# EAGLE design RadioNetwork (EAGLE 7.6.0)
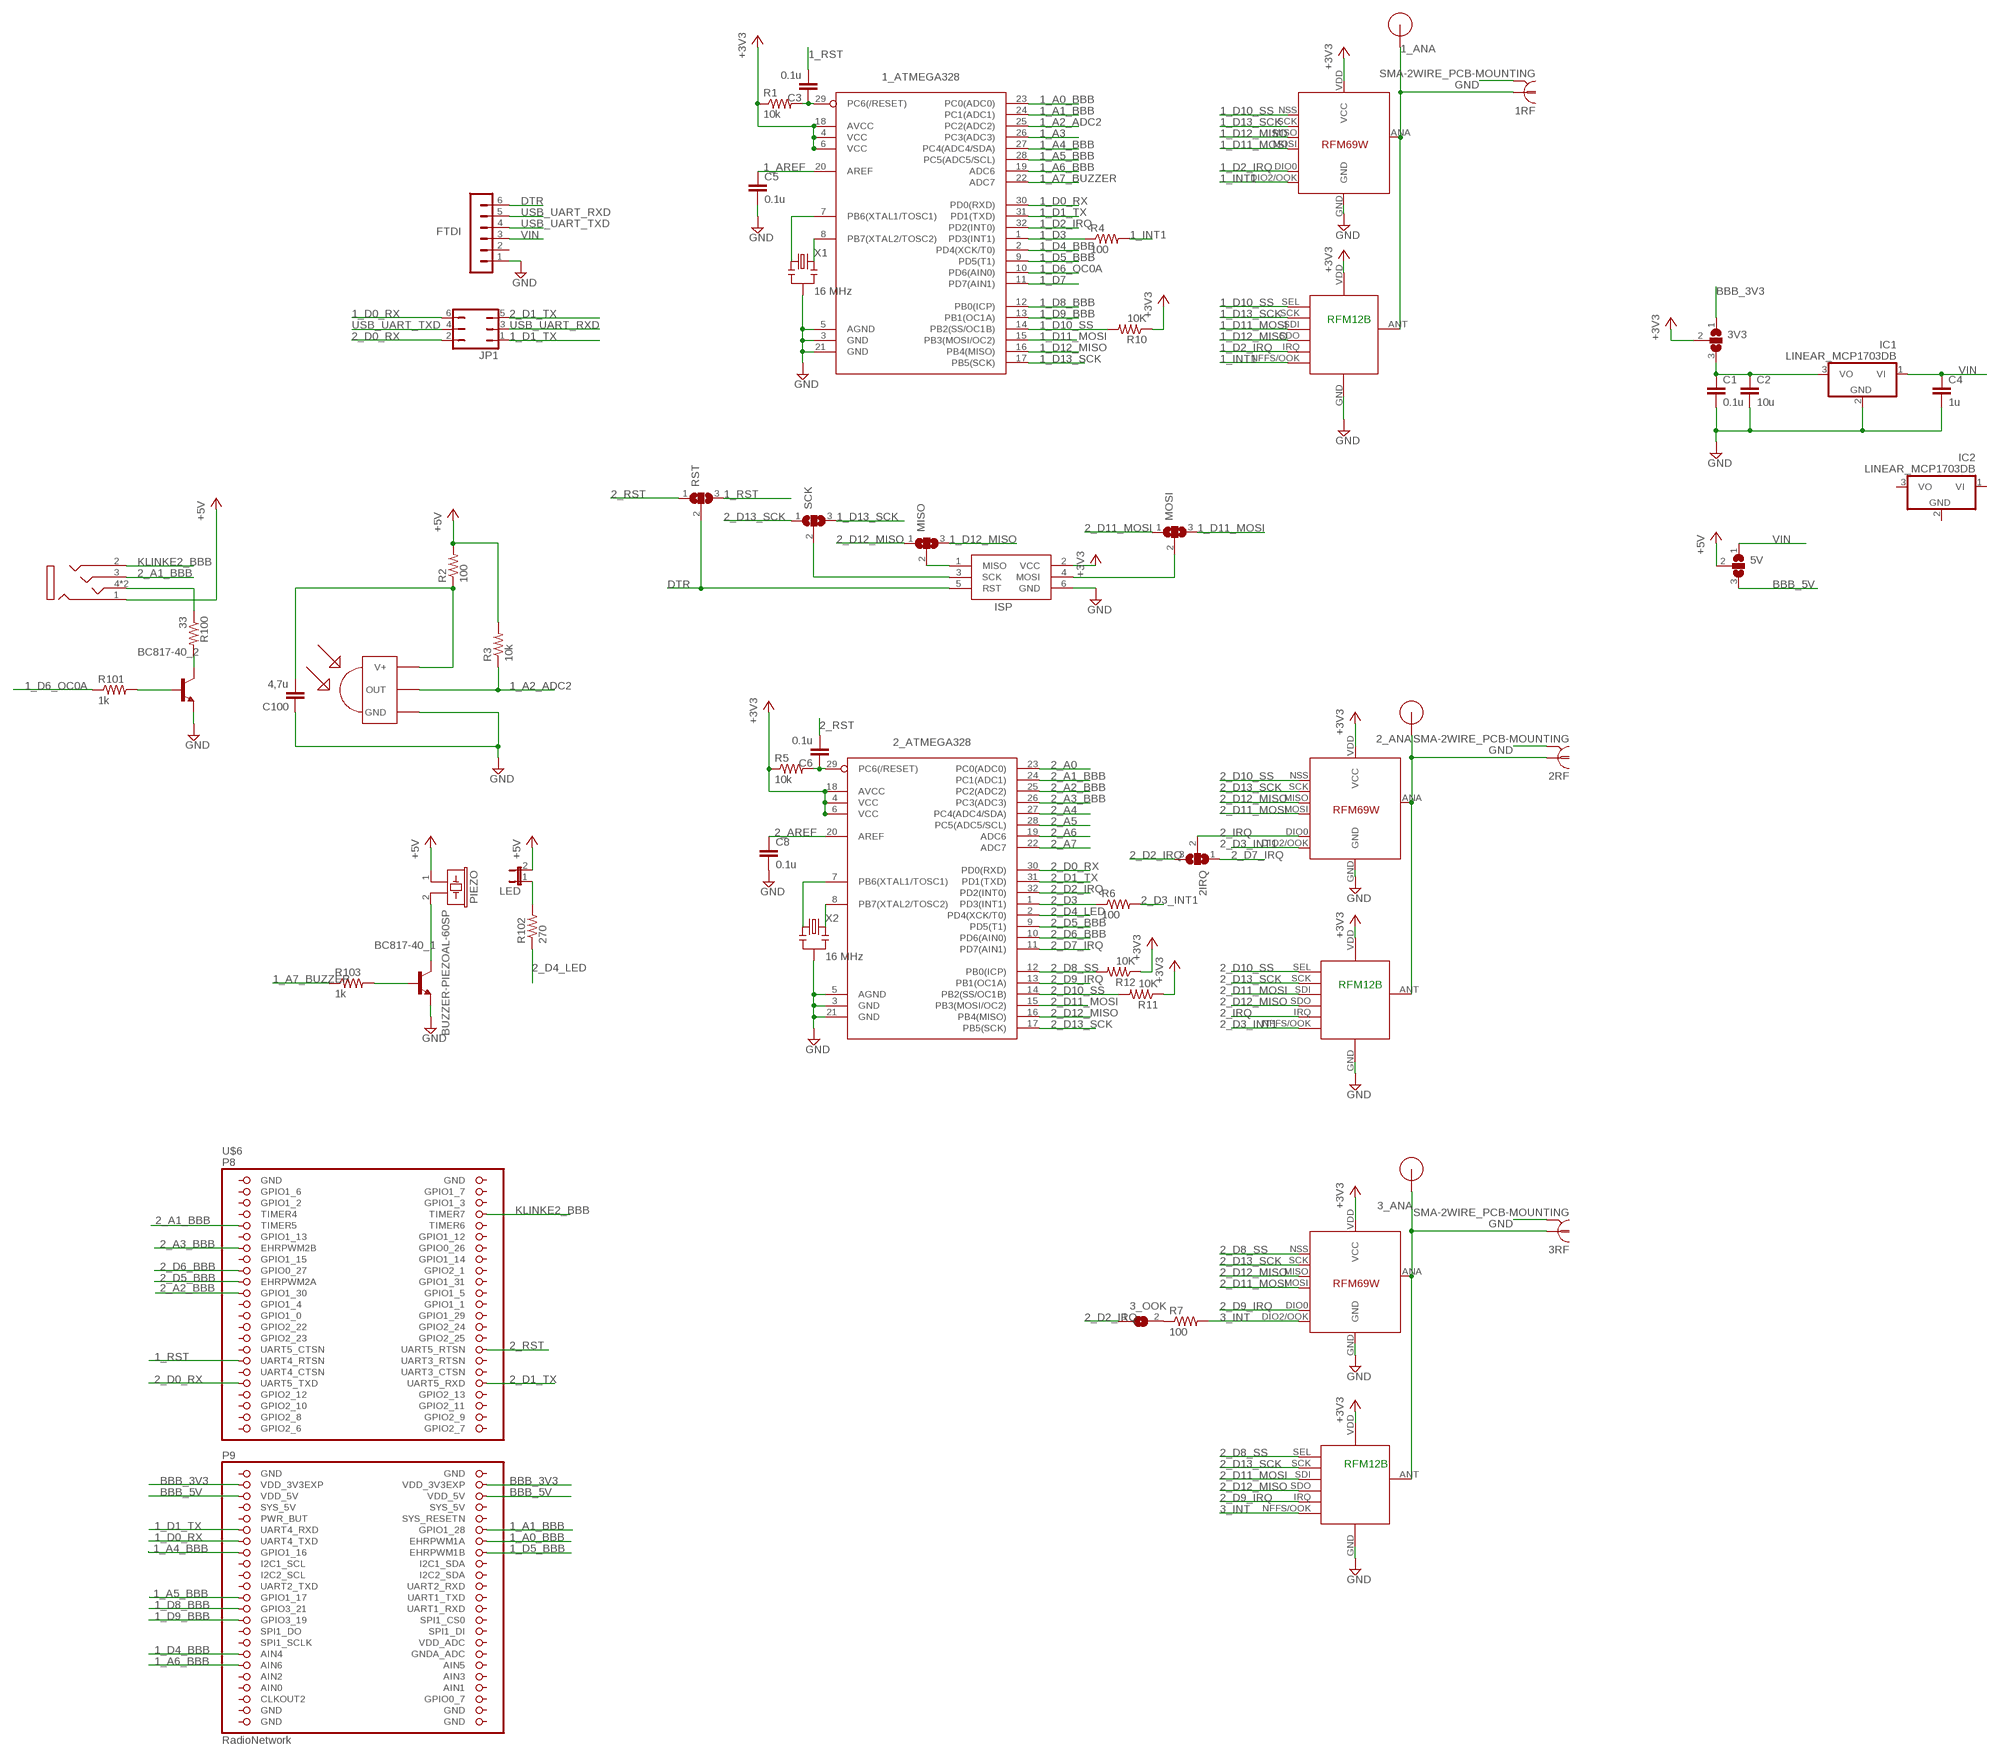
[diagram p0: schematic, sheet 1]

## Parts
1_ATMEGA328  ATMega-328  ATMEGA168/328TQFP32  [TQFP32-08]
1_RFM12B  RFM12B_MINPADS  [RFM12B-MINPADS]
1_RFM69  RFM69_MINIPADS  [RFM69W-MINPADS]
1RF  SMA-2WIRE_PCB-MOUNTING  [J01151A0931]
2_ATMEGA328  ATMega-328  ATMEGA168/328TQFP32  [TQFP32-08]
2_RFM12B  RFM12B_MINPADS  [RFM12B-MINPADS]
2_RFM69  RFM69_MINIPADS  [RFM69W-MINPADS]
2IRQ  SJ2W  [SJ_2]
2RF  SMA-2WIRE_PCB-MOUNTING  [J01151A0931]
3_OOK  SJ  [SJ]
3_RFM12B  RFM12B_MINPADS  [RFM12B-MINPADS]
3_RFM69  RFM69_MINIPADS  [RFM69W-MINPADS]
3RF  SMA-2WIRE_PCB-MOUNTING  [J01151A0931]
3V3  SJ2W  [SJ_2]
5V  SJ2W  [SJ_2]
BC817-40_1  BC817-40-NPN-SOT23-BEC  [SOT23-BEC]
BC817-40_2  BC817-40-NPN-SOT23-BEC  [SOT23-BEC]
C1  0.1u  CAP0603-CAP  [0603-CAP]
C2  10u  CAP0603-CAP  [0603-CAP]
C3  0.1u  CAP0603-CAP  [0603-CAP]
C4  1u  CAP0603-CAP  [0603-CAP]
C5  0.1u  CAP0603-CAP  [0603-CAP]
C6  0.1u  CAP0603-CAP  [0603-CAP]
C8  0.1u  CAP0603-CAP  [0603-CAP]
C100  4,7u  CAP0603-CAP  [0603-CAP]
FTDI  FTDI  MA06-1  [MA06-1]
IC1  LINEAR_MCP1703DB  [LINEAR_SOT223]
IC2  LINEAR_MCP1703DB  [LINEAR_SOT223]
IR-RX  TSOP4836  [TSOP18XX]
IR-TX  1503_13  [1503-03]
ISP  AVRISP-6  [AVRISP]
JP1  JP3Q  [JP3Q]
LED  JP1E  [JP1]
MISO  SJ2W  [SJ_2]
MOSI  SJ2W  [SJ_2]
PIEZO  BUZZER-PIEZOAL-60SP  [AL-60SP05]
R1  10k  RESISTOR0603-RES  [0603-RES]
R2  100  RESISTOR0603-RES  [0603-RES]
R3  10k  RESISTOR0603-RES  [0603-RES]
R4  100  RESISTOR0603-RES  [0603-RES]
R5  10k  RESISTOR0603-RES  [0603-RES]
R6  100  RESISTOR0603-RES  [0603-RES]
R7  100  RESISTOR0603-RES  [0603-RES]
R10  10K  RESISTOR0603-RES  [0603-RES]
R11  10K  RESISTOR0603-RES  [0603-RES]
R12  10K  RESISTOR0603-RES  [0603-RES]
R100  33  RESISTOR0603-RES  [0603-RES]
R101  1k  RESISTOR0603-RES  [0603-RES]
R102  270  RESISTOR0603-RES  [0603-RES]
R103  1k  RESISTOR0603-RES  [0603-RES]
RST  SJ2W  [SJ_2]
SCK  SJ2W  [SJ_2]
U$1  RFM12B_ANTENNA  [RFM12B-ANTENNA]
U$2  RFM12B_ANTENNA  [RFM12B-ANTENNA]
U$5  RFM12B_ANTENNA  [RFM12B-ANTENNA]
U$6  RadioNetwork  BEAGLEBONE_OUTLINE  [BEAGLEBONE_SHIELD]
X1  16 MHz  RESONATORSMD  [RESONATOR-SMD]
X2  16 MHz  RESONATORSMD  [RESONATOR-SMD]

## Nets
1_A0_BBB: 1_ATMEGA328.23(PC0(ADC0)) U$6.60(EHRPWM1A)
1_A1_BBB: 1_ATMEGA328.24(PC1(ADC1)) U$6.58(GPIO1_28)
1_A2_ADC2: 1_ATMEGA328.25(PC2(ADC2)) IR-RX.OUT R3.1
1_A3: 1_ATMEGA328.26(PC3(ADC3))
1_A4_BBB: 1_ATMEGA328.27(PC4(ADC4/SDA)) U$6.61(GPIO1_16)
1_A5_BBB: 1_ATMEGA328.28(PC5(ADC5/SCL)) U$6.69(GPIO1_17)
1_A6_BBB: 1_ATMEGA328.19(ADC6) U$6.81(AIN6)
1_A7_BUZZER: 1_ATMEGA328.22(ADC7) R103.1
1_ANA [ANT]: 1_RFM12B.ANT 1_RFM69.ANA(ANT) 1RF.1 U$1.P$1
1_AREF: 1_ATMEGA328.20(AREF) C5.1
1_D0_RX: 1_ATMEGA328.30(PD0(RXD)) JP1.6 U$6.59(UART4_TXD)
1_D1_TX: 1_ATMEGA328.31(PD1(TXD)) JP1.1 U$6.57(UART4_RXD)
1_D2_IRQ: 1_ATMEGA328.32(PD2(INT0)) 1_RFM12B.IRQ 1_RFM69.DIO0(DIO0/IRQ)
1_D3: 1_ATMEGA328.1(PD3(INT1)) R4.1
1_D4_BBB: 1_ATMEGA328.2(PD4(XCK/T0)) U$6.79(AIN4)
1_D5_BBB: 1_ATMEGA328.9(PD5(T1)) U$6.62(EHRPWM1B)
1_D6_OC0A: 1_ATMEGA328.10(PD6(AIN0)) R101.1
1_D7: 1_ATMEGA328.11(PD7(AIN1))
1_D8_BBB: 1_ATMEGA328.12(PB0(ICP)) U$6.71(GPIO3_21)
1_D9_BBB: 1_ATMEGA328.13(PB1(OC1A)) U$6.73(GPIO3_19)
1_D10_SS: 1_ATMEGA328.14(PB2(SS/OC1B)) 1_RFM12B.SEL 1_RFM69.NSS(SEL) R10.2
1_D11_MOSI: 1_ATMEGA328.15(PB3(MOSI/OC2)) 1_RFM12B.SDI(SDI/MOSI) 1_RFM69.MOSI MOSI.3
1_D12_MISO: 1_ATMEGA328.16(PB4(MISO)) 1_RFM12B.SDO(SDO/MISO) 1_RFM69.MISO MISO.3
1_D13_SCK: 1_ATMEGA328.17(PB5(SCK)) 1_RFM12B.SCK 1_RFM69.SCK SCK.3
1_INT1: 1_RFM12B.NFFS/OOK 1_RFM69.DIO2/OOK R4.2
1_RST: C3.2 RST.3 U$6.33(UART4_RTSN)
2_A0: 2_ATMEGA328.23(PC0(ADC0))
2_A1_BBB: 2_ATMEGA328.24(PC1(ADC1)) IR-TX.3 U$6.9(TIMER5)
2_A2_BBB: 2_ATMEGA328.25(PC2(ADC2)) U$6.21(GPIO1_30)
2_A3_BBB: 2_ATMEGA328.26(PC3(ADC3)) U$6.13(EHRPWM2B)
2_A4: 2_ATMEGA328.27(PC4(ADC4/SDA))
2_A5: 2_ATMEGA328.28(PC5(ADC5/SCL))
2_A6: 2_ATMEGA328.19(ADC6)
2_A7: 2_ATMEGA328.22(ADC7)
2_ANA [ANT]: 2_RFM12B.ANT 2_RFM69.ANA(ANT) 2RF.1 U$5.P$1
2_AREF: 2_ATMEGA328.20(AREF) C8.1
2_D0_RX: 2_ATMEGA328.30(PD0(RXD)) JP1.2 U$6.37(UART5_TXD)
2_D1_TX: 2_ATMEGA328.31(PD1(TXD)) JP1.5 U$6.38(UART5_RXD)
2_D2_IRQ: 2_ATMEGA328.32(PD2(INT0)) 2IRQ.3 3_OOK.1
2_D3: 2_ATMEGA328.1(PD3(INT1)) R6.1
2_D3_INT1: 2_RFM12B.NFFS/OOK 2_RFM69.DIO2/OOK R6.2
2_D4_LED: 2_ATMEGA328.2(PD4(XCK/T0)) R102.1
2_D5_BBB: 2_ATMEGA328.9(PD5(T1)) U$6.19(EHRPWM2A)
2_D6_BBB: 2_ATMEGA328.10(PD6(AIN0)) U$6.17(GPIO0_27)
2_D7_IRQ: 2_ATMEGA328.11(PD7(AIN1)) 2IRQ.1
2_D8_SS: 2_ATMEGA328.12(PB0(ICP)) 3_RFM12B.SEL 3_RFM69.NSS(SEL) R12.2
2_D9_IRQ: 2_ATMEGA328.13(PB1(OC1A)) 3_RFM12B.IRQ 3_RFM69.DIO0(DIO0/IRQ)
2_D10_SS: 2_ATMEGA328.14(PB2(SS/OC1B)) 2_RFM12B.SEL 2_RFM69.NSS(SEL) R11.2
2_D11_MOSI: 2_ATMEGA328.15(PB3(MOSI/OC2)) 2_RFM12B.SDI(SDI/MOSI) 2_RFM69.MOSI 3_RFM12B.SDI(SDI/MOSI) 3_RFM69.MOSI MOSI.1
2_D12_MISO: 2_ATMEGA328.16(PB4(MISO)) 2_RFM12B.SDO(SDO/MISO) 2_RFM69.MISO 3_RFM12B.SDO(SDO/MISO) 3_RFM69.MISO MISO.1
2_D13_SCK: 2_ATMEGA328.17(PB5(SCK)) 2_RFM12B.SCK 2_RFM69.SCK 3_RFM12B.SCK 3_RFM69.SCK SCK.1
2_IRQ: 2_RFM12B.IRQ 2_RFM69.DIO0(DIO0/IRQ) 2IRQ.2
2_RST: C6.2 RST.1 U$6.32(UART5_RTSN)
3_ANA [ANT]: 3_RFM12B.ANT 3_RFM69.ANA(ANT) 3RF.1 U$2.P$1
3_INT: 3_RFM12B.NFFS/OOK 3_RFM69.DIO2/OOK R7.2
+3V3 [power]: 1_ATMEGA328.4(VCC) 1_ATMEGA328.6(VCC) 1_ATMEGA328.18(AVCC) 1_RFM12B.VDD 1_RFM69.VDD(VCC) 2_ATMEGA328.4(VCC) 2_ATMEGA328.6(VCC) 2_ATMEGA328.18(AVCC) 2_RFM12B.VDD 2_RFM69.VDD(VCC) 3_RFM12B.VDD 3_RFM69.VDD(VCC) 3V3.2 ISP.2(VCC) R1.1 R5.1 R10.1 R11.1 R12.1
+5V [power]: 5V.2 IR-TX.1 LED.2 PIEZO.1 R2.2 R3.2
BBB_3V3 [power]: 3V3.1 U$6.49(VDD_3V3EXP) U$6.50(VDD_3V3EXP)
BBB_5V [power]: 5V.3 U$6.51(VDD_5V) U$6.52(VDD_5V)
DTR: FTDI.6 ISP.5(RST) RST.2
GND [power]: 1_ATMEGA328.3(GND) 1_ATMEGA328.5(AGND) 1_ATMEGA328.21(GND) 1_RFM12B.GND 1_RFM69.GND 1RF.G@1 1RF.G@2 1RF.G@3 1RF.G@4 2_ATMEGA328.3(GND) 2_ATMEGA328.5(AGND) 2_ATMEGA328.21(GND) 2_RFM12B.GND 2_RFM69.GND 2RF.G@1 2RF.G@2 2RF.G@3 2RF.G@4 3_RFM12B.GND 3_RFM69.GND 3RF.G@1 3RF.G@2 3RF.G@3 3RF.G@4 BC817-40_1.E BC817-40_2.E C1.2 C2.2 C4.2 C5.2 C8.2 C100.1 FTDI.1 IC1.2(GND) IR-RX.GND ISP.6(GND) X1.2 X2.2
KLINKE2_BBB: IR-TX.2 U$6.8(TIMER7)
N$1: 1_ATMEGA328.7(PB6(XTAL1/TOSC1)) X1.1
N$2 [power]: 3V3.3 C1.1 C2.1 IC1.3(VO)
N$3: 2_ATMEGA328.7(PB6(XTAL1/TOSC1)) X2.1
N$4: BC817-40_2.C R100.2
N$10: 2_ATMEGA328.8(PB7(XTAL2/TOSC2)) X2.3
N$11: 2_ATMEGA328.29(PC6(/RESET)) C6.1 R5.2
N$12: 3_OOK.2 R7.1
N$13: BC817-40_1.C PIEZO.2
N$14: 1_ATMEGA328.29(PC6(/RESET)) C3.1 R1.2
N$15: BC817-40_1.B R103.2
N$16: C100.2 IR-RX.VCC(V+) R2.1
N$17: IR-TX.4 IR-TX.4-2 R100.1
N$19: BC817-40_2.B R101.2
N$21: 1_ATMEGA328.8(PB7(XTAL2/TOSC2)) X1.3
N$22: LED.1 R102.2
N$23: ISP.1(MISO) MISO.2
N$24: ISP.4(MOSI) MOSI.2
N$25: ISP.3(SCK) SCK.2
USB_UART_RXD: FTDI.5 JP1.3
USB_UART_TXD: FTDI.4 JP1.4
VIN [power]: 5V.1 C4.1 FTDI.3 IC1.1(VI)
Unconnected: FTDI.2 IC2.1(VI) IC2.2(GND) IC2.3(VO) U$6.3(GPIO1_6) U$6.4(GPIO1_7) U$6.5(GPIO1_2) U$6.6(GPIO1_3) U$6.7(TIMER4) U$6.10(TIMER6) U$6.11(GPIO1_13) U$6.12(GPIO1_12) U$6.14(GPIO0_26) U$6.15(GPIO1_15) U$6.16(GPIO1_14) U$6.18(GPIO2_1) U$6.20(GPIO1_31) U$6.22(GPIO1_5) U$6.23(GPIO1_4) U$6.24(GPIO1_1) U$6.25(GPIO1_0) U$6.26(GPIO1_29) U$6.27(GPIO2_22) U$6.28(GPIO2_24) U$6.29(GPIO2_23) U$6.30(GPIO2_25) U$6.31(UART5_CTSN) U$6.34(UART3_RTSN) U$6.35(UART4_CTSN) U$6.36(UART3_CTSN) U$6.39(GPIO2_12) U$6.40(GPIO2_13) U$6.41(GPIO2_10) U$6.42(GPIO2_11) U$6.43(GPIO2_8) U$6.44(GPIO2_9) U$6.45(GPIO2_6) U$6.46(GPIO2_7) U$6.54(SYS_5V) U$6.55(PWR_BUT) U$6.56(SYS_RESETN) U$6.63(I2C1_SCL) U$6.64(I2C1_SDA) U$6.65(I2C2_SCL) U$6.66(I2C2_SDA) U$6.67(UART2_TXD) U$6.68(UART2_RXD) U$6.70(UART1_TXD) U$6.72(UART1_RXD) U$6.74(SPI1_CS0) U$6.75(SPI1_DO) U$6.76(SPI1_DI) U$6.77(SPI1_SCLK) U$6.78(VDD_ADC) U$6.80(GNDA_ADC) U$6.82(AIN5) U$6.83(AIN2) U$6.84(AIN3) U$6.86(AIN1) U$6.87(CLKOUT2) U$6.88(GPIO0_7)

## Notes on the sheet
- RFM12B
- RFM12B
- RFM12B

## Power pins joined to a net without a drawn wire
AIN0: U$6.85(AIN0)
GND: U$6.1(GND) U$6.2(GND) U$6.47(GND) U$6.48(GND) U$6.89(GND) U$6.90(GND) U$6.91(GND) U$6.92(GND)
SYS_5V: U$6.53(SYS_5V)

## Library data of the parts
1_ATMEGA328 2_ATMEGA328 = myLib:ATMEGA168/328: Atmel 32-pin 8-bit micro, 16k flash.; BUERKLIN: 64 S 3046
1_RFM12B 2_RFM12B 3_RFM12B = myLib:RFM12B_MINPADS
1_RFM69 2_RFM69 3_RFM69 = myLib:RFM69_MINIPADS
1RF 2RF 3RF = myLib:SMA-2WIRE_PCB-MOUNTING: SMA 50 Ohm Straight Jack Receptacle - PCB Mountung www.telegaertner.de Source: Buerklin Artikelnummer: J01151A0931; BUERKLIN: 76F410
2IRQ 3V3 5V MISO MOSI RST SCK = jumper:SJ2W: SMD solder JUMPER
3_OOK = jumper:SJ: SMD solder JUMPER
BC817-40_1 BC817-40_2 = myLib:*-NPN-: NPN Transistror BF959 corrected 2008.03.06; BUERKLIN: 12S6220
C1 C3 C5 C6 C8 = LowPowerLab:CAP: Capacitor Standard 0603 ceramic capacitor, and 0.1" leaded capacitor.; BUERKLIN: 53 D 1726
C2 = LowPowerLab:CAP: Capacitor Standard 0603 ceramic capacitor, and 0.1" leaded capacitor.; BUERKLIN: 53 D 1652
C4 = LowPowerLab:CAP: Capacitor Standard 0603 ceramic capacitor, and 0.1" leaded capacitor.; BUERKLIN: 53 D 1657
C100 = LowPowerLab:CAP: Capacitor Standard 0603 ceramic capacitor, and 0.1" leaded capacitor.; BUERKLIN: 53 D 1659
FTDI = JeeLabs:MA06-1: PIN HEADER; BUERKLIN: 59 F 2134
IC1 IC2 = myLib:LINEAR_MCP1703: 250 mA, 16V, Low Quiescent Current LDO Regulator Source: http://ww1.microchip.com/downloads/en/DeviceDoc/22049b.pdf; BUERKLIN: 41 S 7654
IR-RX = myLib:TSOP4836: IR Receiver and Demodulator; CONRAD: 171107-62
IR-TX = myLib:1503_13; BUERKLIN: 39F1215
ISP = adafruit:AVRISP: AVR ISP HEADER Standard 6 pin header for AVR programming; CONRAD: 737480 - 62
JP1 = myLib:JP3Q: JUMPER; CONRAD: 737480 - 62
LED = jumper:JP1E: JUMPER
PIEZO = myLib:BUZZER-PIEZO: Piezoelectric Acoustic Transducer; CONRAD: 751553 - 62; OC_FARNELL: unknown; OC_NEWARK: unknown
R1 R3 R5 R10-R12 = LowPowerLab:RESISTOR: Resistor Basic schematic elements and footprints for 0603, 1206, and PTH resistors.; BUERKLIN: 26 E 816
R2 R4 R6 R7 = LowPowerLab:RESISTOR: Resistor Basic schematic elements and footprints for 0603, 1206, and PTH resistors.; BUERKLIN: 26 E 768
R100 = LowPowerLab:RESISTOR: Resistor Basic schematic elements and footprints for 0603, 1206, and PTH resistors.; BUERKLIN: 26 E 756
R101 R103 = LowPowerLab:RESISTOR: Resistor Basic schematic elements and footprints for 0603, 1206, and PTH resistors.; BUERKLIN: 26 E 792
R102 = LowPowerLab:RESISTOR: Resistor Basic schematic elements and footprints for 0603, 1206, and PTH resistors.; BUERKLIN: 26 E 778
U$1 U$2 U$5 = LowPowerLab:RFM12B_ANTENNA
U$6 = myLib:BEAGLEBONE_OUTLINE: Should match A3 pinout - but not completely tested; CONRAD: 393509 - 62
X1 X2 = SparkFun:RESONATOR: Resonator Small SMD resonator. This is the itty bitty 10/20MHz resonators with built in caps. CSTCE10M0G55 and CSTCE20M0V53. Footprint has been reviewed closely but hasn't been tested yet.

## Net classes
1 power: width 0.356 mm, clearance 0.254 mm
2 ANT: width 0.381 mm, clearance 0.254 mm

## Board
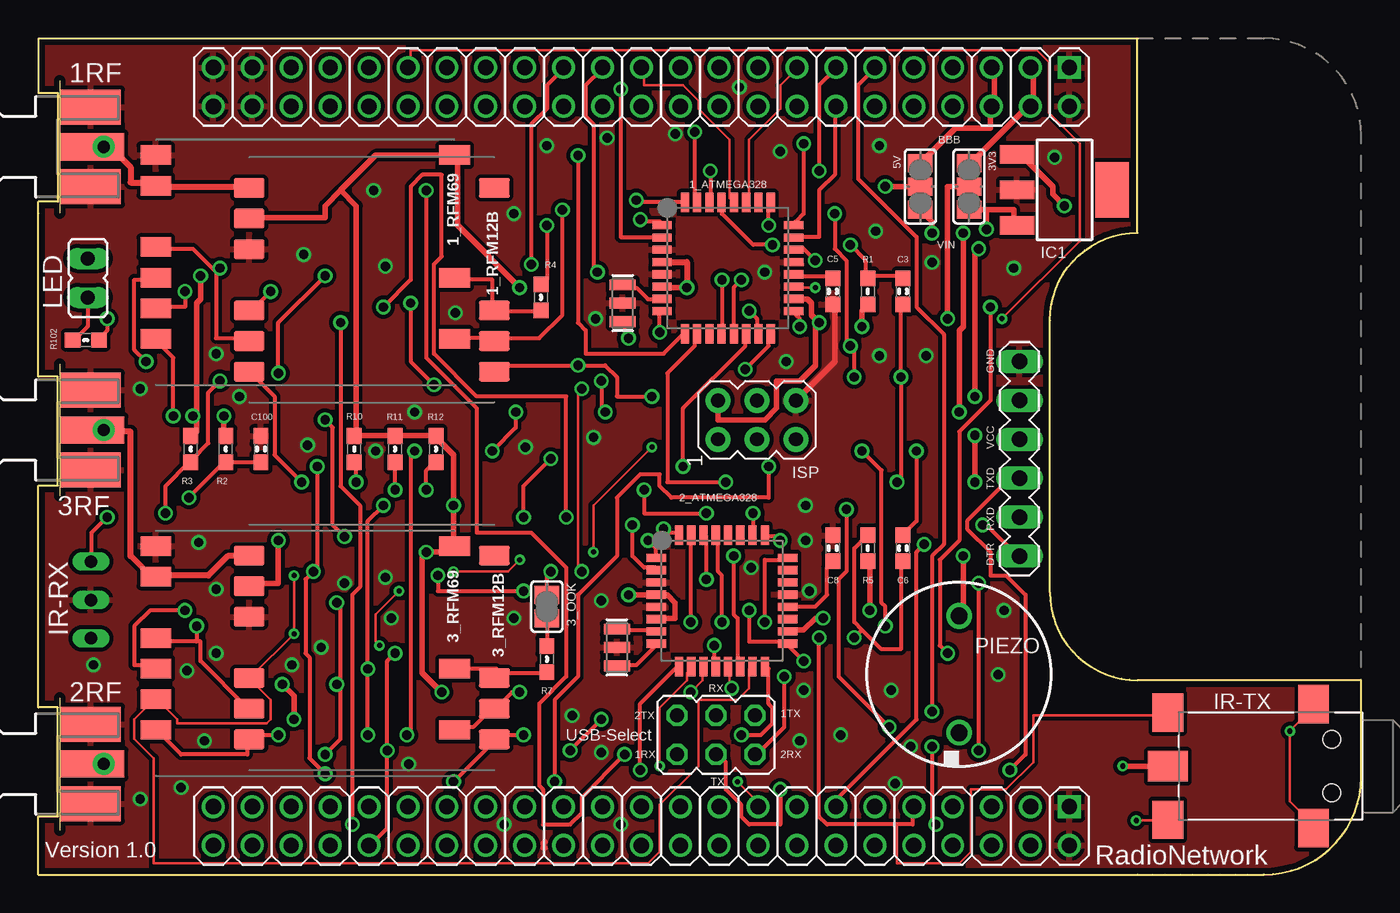
[diagram p1: board, top side]
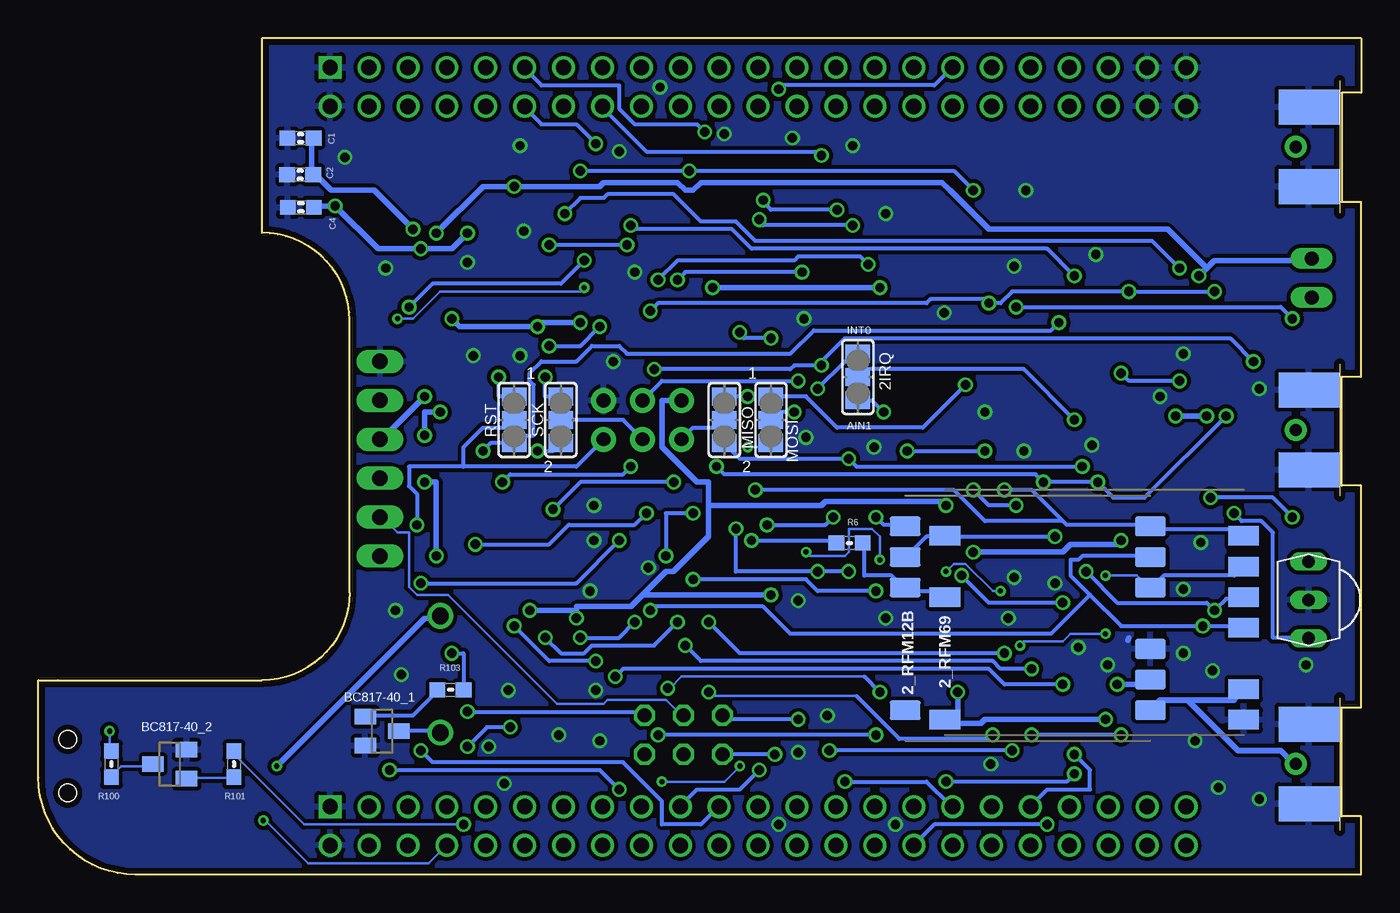
[diagram p2: board, bottom side, seen from below]

Size 86.36 x 54.61 mm. Coordinates in mm from the lower left corner, seen from the top.
Copper layers (1*16): Top 0.0356mm / dielectric 1.5011mm / Bottom 0.0356mm
Design rules "LaenPCBOrder": minimum track width 6mil, minimum drill 13mil, track to track 6mil, track to pad 6mil, pad to pad 6mil, via to via 6mil, smd to smd 6mil, copper to edge 15mil, drill to drill 6mil, minimum pad ring 7mil, minimum via ring 7mil, stop-mask expansion 3mil, vias tented up to drill 0mil, thermal gap 10mil

### Footprints (pad centres in the part's own frame; a part is rotated, then mirrored left to right if it is on the bottom)
TQFP32-08 = smd 1.27 x 0.533: 1 -4.293,2.8; 2 -4.293,2; 3 -4.293,1.2; 4 -4.293,0.4; 5 -4.293,-0.4; 6 -4.293,-1.2; 7 -4.293,-2; 8 -4.293,-2.8; 17 4.293,-2.8; 18 4.293,-2; 19 4.293,-1.2; 20 4.293,-0.4; 21 4.293,0.4; 22 4.293,1.2; 23 4.293,2; 24 4.293,2.8 | smd 0.533 x 1.27: 9 -2.8,-4.293; 10 -2,-4.293; 11 -1.2,-4.293; 12 -0.4,-4.293; 13 0.4,-4.293; 14 1.2,-4.293; 15 2,-4.293; 16 2.8,-4.293; 25 2.8,4.293; 26 2,4.293; 27 1.2,4.293; 28 0.4,4.293; 29 -0.4,4.293; 30 -1.2,4.293; 31 -2,4.293; 32 -2.8,4.293
RFM12B-MINPADS = smd 2 x 1.27: ANT 8,-6; GND 8,-2; IRQ -8,4; NFFS/OOK -8,2; SCK 8,4; SDI 8,2; SDI1 -8.002,-6.001; SDO -8,6; SEL 8,6; VDD 8,-4
RFM69W-MINPADS = smd 2 x 1.27: ANA 8,-5; DIO0 -11.5,5; DIO2/OOK -11.5,1; GND 8,-7; MISO 8,1; MOSI 8,3; NSS 8,5; SCK 8,-1; VDD -11.5,-7
J01151A0931 = smd 4.191 x 1.778: 1 2.134,0 | smd 3.937 x 2.286: G@1 2.032,2.6; G@2 2.032,-2.6 | smd 3.937 x 2.286 bottom: G@3 2.032,2.6; G@4 2.032,-2.6
SJ_2 = smd 1.168 x 1.6: 1 -1.524,0; 2 0,0; 3 1.524,0
SJ = smd 1.168 x 1.6: 1 -0.762,0; 2 0.762,0
SOT23-BEC = smd 1 x 1.4: B -0.95,-1.1; C 0,1.1; E 0.95,-1.1
0603-CAP = smd 1.016 x 0.965: 1 -0.85,0; 2 0.85,0
MA06-1 = drill 1.016 long: 1 0,0; 2 2.54,0; 3 5.08,0; 4 7.62,0; 5 10.16,0; 6 12.7,0
LINEAR_SOT223 = smd 1.219 x 2.235: 1 -2.311,-3.099; 2 0,-3.099; 3 2.311,-3.099 | smd 3.6 x 2.2: 4 0,3.099
TSOP18XX = drill 0.813 long: GND -0.001,-0.027; OUT -2.501,-0.027; VCC 2.499,-0.027
1503-03 = smd 2.6 x 2: 1 12.7,0 | smd 2 x 2.5: 2 12.7,3.5; 3 12.7,-3.5; 4 3.2,4.05; 4-2 3.2,-4.05 | hole 1.15: 2,-1.75; 2,1.75
AVRISP = drill 0.9 pad 1.626: 1 -1.27,2.54; 2 1.27,2.54; 3 -1.27,0; 4 1.27,0; 5 -1.27,-2.54; 6 1.27,-2.54
JP3Q = drill 0.914 octagon: 1 -2.54,-1.27; 2 -2.54,1.27; 3 0,-1.27; 4 0,1.27; 5 2.54,-1.27; 6 2.54,1.27
JP1 = drill 0.914 long: 1 0,-1.27; 2 0,1.27
AL-60SP05 = drill 1.1 pad 1.676: 1 -3.81,0; 2 3.81,0
0603-RES = smd 1.016 x 0.965: 1 -0.85,0; 2 0.85,0
RFM12B-ANTENNA = drill 0.8 pad 1.422: P$1 0,0
BEAGLEBONE_SHIELD = drill 1 square: 1 4.445,19.05; 47 52.705,19.05 | drill 1: 2 1.905,19.05; 3 4.445,21.59; 4 1.905,21.59; 5 4.445,24.13; 6 1.905,24.13; 7 4.445,26.67; 8 1.905,26.67; 9 4.445,29.21; 10 1.905,29.21; 11 4.445,31.75; 12 1.905,31.75; 13 4.445,34.29; 14 1.905,34.29; 15 4.445,36.83; 16 1.905,36.83; 17 4.445,39.37; 18 1.905,39.37; 19 4.445,41.91; 20 1.905,41.91; 21 4.445,44.45; 22 1.905,44.45; 23 4.445,46.99; 24 1.905,46.99; 25 4.445,49.53; 26 1.905,49.53; 27 4.445,52.07; 28 1.905,52.07; 29 4.445,54.61; 30 1.905,54.61; 31 4.445,57.15; 32 1.905,57.15; 33 4.445,59.69; 34 1.905,59.69; 35 4.445,62.23; 36 1.905,62.23; 37 4.445,64.77; 38 1.905,64.77; 39 4.445,67.31; 40 1.905,67.31; 41 4.445,69.85; 42 1.905,69.85; 43 4.445,72.39; 44 1.905,72.39; 45 4.445,74.93; 46 1.905,74.93; 48 50.165,19.05; 49 52.705,21.59; 50 50.165,21.59; 51 52.705,24.13; 52 50.165,24.13; 53 52.705,26.67; 54 50.165,26.67; 55 52.705,29.21; 56 50.165,29.21; 57 52.705,31.75; 58 50.165,31.75; 59 52.705,34.29; 60 50.165,34.29; 61 52.705,36.83; 62 50.165,36.83; 63 52.705,39.37; 64 50.165,39.37; 65 52.705,41.91; 66 50.165,41.91; 67 52.705,44.45; 68 50.165,44.45; 69 52.705,46.99; 70 50.165,46.99; 71 52.705,49.53; 72 50.165,49.53; 73 52.705,52.07; 74 50.165,52.07; 75 52.705,54.61; 76 50.165,54.61; 77 52.705,57.15; 78 50.165,57.15; 79 52.705,59.69; 80 50.165,59.69; 81 52.705,62.23; 82 50.165,62.23; 83 52.705,64.77; 84 50.165,64.77; 85 52.705,67.31; 86 50.165,67.31; 87 52.705,69.85; 88 50.165,69.85; 89 52.705,72.39; 90 50.165,72.39; 91 52.705,74.93; 92 50.165,74.93
RESONATOR-SMD = smd 0.7 x 1.7: 1 -1.2,0; 2 0,0; 3 1.2,0

### Placement (x,y rotation side)
1_ATMEGA328  45.01,39.6 0 top
1_RFM12B  21.77,38.84 180 top
1_RFM69  15.67,39.98 180 top
1RF  1.38,47.52 0 top
2_ATMEGA328  44.63,17.88 0 top
2_RFM12B  21.77,16.74 0 bottom
2_RFM69  15.67,17.12 0 bottom
2IRQ  32.86,32.5 90 bottom
2RF  1.38,7.23 0 top
3_OOK  33.2,17.5 270 top
3_RFM12B  21.77,14.84 180 top
3_RFM69  15.67,14.46 180 top
3RF  1.38,29.03 0 top
3V3  60.76,44.94 270 top
5V  57.58,44.94 90 top
BC817-40_1  63.91,9.37 270 bottom
BC817-40_2  77.78,7.22 90 bottom
C1  69.23,48.09 180 bottom
C2  69.27,45.7 180 bottom
C3  56.44,38.08 270 top
C4  69.22,43.56 180 bottom
C5  51.87,38.08 270 top
C6  56.44,21.31 90 top
C8  51.87,21.31 90 top
C100  14.53,27.79 270 top
FTDI  64.06,33.51 270 top
IC1  67,44.71 270 top
IC2  -20.14,-5.36 0 top  (outside the outline)
IR-RX  3.46,17.94 90 bottom
IR-TX  86.44,7.09 180 top
ISP  46.91,29.7 90 top
JP1  44.25,9.12 180 top
LED  3.24,38.95 0 top
MISO  41.58,29.7 90 bottom
MOSI  38.53,29.7 90 bottom
PIEZO  60.11,13.08 270 top
R1  54.15,38.08 90 top
R2  12.24,27.79 90 top
R3  9.96,27.79 90 top
R4  32.82,37.7 270 top
R5  54.15,21.31 90 top
R6  33.41,21.65 0 bottom
R7  33.2,14.07 270 top
R10  20.62,27.79 270 top
R11  23.29,27.79 270 top
R12  25.96,27.79 270 top
R100  81.58,7.22 270 bottom
R101  73.58,7.22 270 bottom
R102  3.1,34.9 180 top
R103  59.45,12.07 180 bottom
RST  55.3,29.7 90 bottom
SCK  52.25,29.7 90 bottom
U$1  4.26,47.52 0 top
U$2  4.26,29.03 0 top
U$5  4.26,7.23 0 top
U$6  86.36,0 90 top
X1  38.15,37.32 270 top
X2  37.77,14.84 270 top

### Tracks (layer width: path | path; a pad name or v marks a point on that pad's centre or on a via)
1_A0_BBB
  Top 0.254: 1_ATMEGA328.23 49.45,41.63 50.98,41.63 50.98,44.68 51.99,45.7 51.99,50.02 U$6.60
1_A1_BBB  (via drill 0.61)
  Top 0.254: v49.96,47.73 49.96,43.16 49.45,42.65 1_ATMEGA328.24
  Bottom 0.254: U$6.58 54.53,50.02 53.52,49 51.99,49 51.23,49 v49.96,47.73
1_A2_ADC2  (via drill 0.61)
  Top 0.254: v8.31,23.6 8.31,25.38 9.83,26.9 R3.1 10.08,27.16 11.1,28.17 11.1,31.47 v11.86,32.24 | v47.68,42.4 47.68,43.67 1_ATMEGA328.25 | v18.72,39.09 15.67,36.05 v15.67,32.74
  Bottom 0.254: v8.31,23.6 7.8,23.09 6.53,23.09 5.77,22.33 5.77,15.47 3.48,15.47 IR-RX.OUT | v47.68,42.4 47.42,42.14 41.07,42.14 39.8,40.87 20.5,40.87 v18.72,39.09 | v15.67,32.74 15.16,32.24 v11.86,32.24
1_A4_BBB
  Top 0.152: 1_ATMEGA328.27 46.41,43.92 46.41,47.98 48.44,50.02 48.44,51.54 49.45,52.56 U$6.61
1_A5_BBB
  Top 0.152: 1_ATMEGA328.28 45.39,43.92 45.14,44.17 45.14,47.98 43.1,50.02 43.1,50.52 42.09,51.54 39.55,51.54 39.55,52.56 U$6.69
1_A6_BBB  (via drill 0.33)
  Top 0.152: v50.72,38.33 49.45,38.33 1_ATMEGA328.19 | v62.92,36.3 68,41.38 68,47.73 65.96,49.76 65.96,53.06 65.2,53.83 24.31,53.83 24.31,52.81 U$6.81
  Bottom 0.152: v50.72,38.33 50.98,38.08 60.12,38.08 61.9,36.3 v62.92,36.3
1_A7_BUZZER  (via drill 0.61)
  Top 0.254: v59.36,14.46 58.85,14.96 58.85,20.55 60.12,21.82 60.12,28.93 62.15,30.97 v62.15,37.06 | v50.72,40.11 49.96,40.87 49.45,40.87 1_ATMEGA328.22
  Bottom 0.254: v59.36,14.46 58.6,14.46 58.6,12.17 R103.1 | v62.15,37.06 60.63,38.59 52.25,38.59 v50.72,40.11
1_ANA
  Top 0.381: 1RF.1 3.73,47.22 4.24,47.22 U$1.P$1 4.5,47.73 6.02,46.21 6.02,45.19 7.54,45.19 1_RFM69.ANA 7.8,44.94 13.64,44.94 1_RFM12B.ANT
1_AREF
  Top 0.254: C5.1 51.74,39.09 49.45,39.09 1_ATMEGA328.20
1_D0_RX  (via drill 0.61)
  Top 0.254: v43.87,45.95 43.87,43.92 1_ATMEGA328.30 | v50.98,45.95 50.98,51.54 51.99,52.56 U$6.59 | v38.28,7.85 35.48,5.06 35.48,4.04 34.72,3.28 32.94,3.28 32.94,5.57 32.69,5.82 32.69,11.15 34.47,12.93 34.47,20.04 32.18,22.33 28.63,22.33 28.63,30.46 25.32,33.76 v25.32,44.68
  Bottom 0.254: v50.98,45.95 v43.87,45.95 26.59,45.95 v25.32,44.68 | v38.28,7.85 41.58,7.85 JP1.6
1_D1_TX  (via drill 0.61)
  Top 0.254: v42.85,48.49 42.85,43.92 1_ATMEGA328.31 | v58.34,10.65 58.34,20.81 59.11,21.57 59.11,35.28 57.33,37.06 57.33,41.63 53.52,45.44 53.52,51.54 54.53,52.56 U$6.57
  Bottom 0.254: v42.85,48.49 43.36,49 47.42,49 48.44,50.02 48.44,51.54 53.52,51.54 54.53,52.56 U$6.57 | v58.34,10.65 47.17,10.65 46.91,10.39 JP1.1
1_D2_IRQ  (via drill 0.61)
  Top 0.254: v34.21,43.41 34.21,36.55 32.69,35.03 29.9,35.03 1_RFM12B.IRQ 29.64,35.03 27.36,35.03 1_RFM69.DIO0 | 42.09,43.67 1_ATMEGA328.32 42.09,43.92 39.04,43.92 v39.04,44.05
  Bottom 0.254: v34.21,43.41 38.53,43.41 39.04,43.92 v39.04,44.05
1_D3  (via drill 0.61)
  Top 0.254: v33.2,42.4 33.2,38.84 32.94,38.59 R4.1 | 40.56,42.4 1_ATMEGA328.1 40.56,42.65 39.29,42.65 v39.29,42.78
  Bottom 0.254: v33.2,42.4 39.04,42.4 39.29,42.65 v39.29,42.78
1_D4_BBB  (via drill 0.61)
  Top 0.254: 40.56,41.63 1_ATMEGA328.2 40.56,41.63 | 40.56,41.63 38.02,41.63 v38.02,51.29
  Bottom 0.254: v38.02,51.29 37.77,51.54 27.86,51.54 26.85,52.56 U$6.79
1_D5_BBB  (via drill 0.61)
  Top 0.254: v35.23,46.97 35.23,36.05 35.74,35.54 35.74,34.01 40.82,34.01 42.09,35.28 1_ATMEGA328.9
  Bottom 0.254: v35.23,46.97 35.48,47.22 46.66,47.22 49.45,50.02 U$6.62
1_D6_OC0A  (via drill 0.61)
  Top 0.254: v58.6,3.28 58.34,3.53 v58.34,8.36 | v55.55,9.63 52.25,12.93 52.25,19.28 52.76,19.79 v52.76,23.85 | v44.88,25.63 41.07,25.63 41.07,32.74 42.85,34.52 42.85,35.28 1_ATMEGA328.10
  Bottom 0.152: v58.6,3.28 69.01,3.28 73.58,7.85 R101.1
  Bottom 0.254: v58.34,8.36 57.07,9.63 v55.55,9.63 | v52.76,23.85 50.98,25.63 v44.88,25.63
1_D8_BBB  (via drill 0.61)
  Top 0.254: v44.63,38.84 44.63,35.54 1_ATMEGA328.12 | v36.5,39.35 36.25,39.6 36.25,49 35.74,49.51 35.74,51.54 36.75,52.56 U$6.71
  Bottom 0.254: v44.63,38.84 44.12,39.35 v36.5,39.35
1_D9_BBB  (via drill 0.61)
  Top 0.254: v45.9,38.84 45.39,38.33 45.39,35.54 1_ATMEGA328.13 | v32.18,39.86 32.18,49 33.2,50.02 33.2,51.54 34.21,52.56 U$6.73
  Bottom 0.254: v45.9,38.84 44.63,40.11 37.01,40.11 36.75,40.36 32.69,40.36 v32.18,39.86
1_D10_SS  (via drill 0.61)
  Top 0.254: v20.75,25.63 20.75,26.9 R10.2 | v17.2,25.63 15.42,27.41 15.42,31.22 13.89,32.74 1_RFM12B.SEL | v42.09,26.65 42.09,30.46 46.15,34.52 46.15,35.28 1_ATMEGA328.14 | v8.81,29.95 8.81,33.76 7.8,34.78 1_RFM69.NSS
  Bottom 0.254: v42.09,26.65 41.58,26.14 21.26,26.14 v20.75,25.63 v17.2,25.63 16.18,24.62 14.15,24.62 v8.81,29.95
1_D11_MOSI  (via drill 0.61)
  Top 0.254: v46.41,36.81 46.91,36.3 46.91,35.54 1_ATMEGA328.15 | v15.16,38.08 13.89,36.81 1_RFM12B.SDI | v25.83,31.98 24.31,33.51 v24.31,37.32 | v9.58,38.08 9.58,37.06 7.8,37.06 1_RFM69.MOSI
  Bottom 0.254: v46.41,36.81 45.9,37.32 28.37,37.32 28.12,37.57 24.56,37.57 v24.31,37.32 23.55,37.32 22.78,38.08 v15.16,38.08 v9.58,38.08 | MOSI.3 36.25,31.22 34.21,29.19 28.63,29.19 v25.83,31.98
1_D12_MISO  (via drill 0.61)
  Top 0.254: v46.15,33 47.68,34.52 47.68,35.28 1_ATMEGA328.16 | 1_RFM12B.SDO 29.9,33 29.9,33.25 v35.23,33.25 37.01,33.25 37.77,32.49 37.77,31.22 v40.06,31.22 | v7.04,33.51 6.27,34.27 6.27,38.84 7.54,38.84 1_RFM69.MISO
  Bottom 0.254: v46.15,33 37.26,33 37.01,33.25 35.48,33.25 | 35.48,33.25 v35.23,33.25 35.48,33.25 | v40.06,31.22 MISO.3 | v7.04,33.51 8.56,35.03 33.71,35.03 35.48,33.25
1_D13_SCK  (via drill 0.61)
  Top 0.254: v49.71,35.79 49.71,36.3 49.45,36.55 1_ATMEGA328.17 | v53.26,32.49 53.26,34.27 v53.01,34.52 52.76,34.78 52.76,40.11 51.99,40.87 v51.99,43.16 | 11.61,39.35 11.61,35.03 13.64,35.03 1_RFM12B.SCK | 11.61,39.35 10.08,40.87 7.8,40.87 1_RFM69.SCK | 11.61,39.35 v11.86,39.6
  Bottom 0.254: v49.71,35.79 50.98,34.52 v53.01,34.52 | v53.26,32.49 53.26,31.22 SCK.3 | v51.99,43.16 50.98,44.17 49.45,44.17 49.2,44.43 44.88,44.43 43.1,42.65 40.82,42.65 39.55,41.38 13.64,41.38 v11.86,39.6
1_INT1
  Top 0.254: R4.2 32.69,36.81 29.9,36.81 1_RFM12B.NFFS/OOK 29.64,37.06 29.64,38.84 27.36,38.84 1_RFM69.DIO2/OOK
1_RST  (via drill 0.61)
  Top 0.254: C3.2 56.31,37.06 v56.31,32.49 56.31,25.89 v56.06,25.63 | v33.71,6.07 33.71,11.41 35.23,12.93 35.23,18.27 37.77,20.81 37.77,24.62 39.29,26.14 40.56,26.14 40.56,25.38 41.33,24.62 47.68,24.62 v47.68,26.65
  Bottom 0.254: v56.31,32.49 56.31,31.22 RST.3 | v33.71,6.07 28.37,6.07 26.85,4.55 U$6.33 | v47.68,26.65 48.18,26.14 55.55,26.14 v56.06,25.63
2_A1_BBB  (via drill 0.61)
  Top 0.152: 56.06,3.28 56.06,0.74 60.12,0.74 60.88,1.5 60.88,5.57 63.17,5.57 64.95,7.34 64.95,10.39 73.58,10.39 IR-TX.3
  Top 0.254: v47.42,16.49 47.42,20.55 48.69,20.55 2_ATMEGA328.24 | v50.98,15.47 50.98,3.79 51.49,3.28 56.06,3.28 57.07,3.28 57.07,4.3 U$6.9
  Bottom 0.254: v47.42,16.49 48.44,15.47 v50.98,15.47
2_A2_BBB  (via drill 0.61)
  Top 0.254: v48.44,21.82 48.44,22.08 47.68,22.08 2_ATMEGA328.25 | v61.39,8.11 v61.39,19.03
  Bottom 0.254: v48.44,21.82 51.23,19.03 v61.39,19.03 | v61.39,8.11 60.63,7.34 48.18,7.34 45.64,4.8 45.64,3.28 43.1,3.28 42.09,4.3 U$6.21
2_A3_BBB  (via drill 0.61)
  Top 0.254: v46.66,23.6 46.66,22.33 2_ATMEGA328.26 | v57.84,21.57 57.33,21.06 57.33,10.14 52.25,5.06 52.25,4.55 U$6.13
  Bottom 0.254: v46.66,23.6 47.42,22.84 51.74,22.84 53.01,21.57 v57.84,21.57
2_ANA
  Top 0.381: U$5.P$1 4.24,7.34 3.73,7.34 2RF.1
  Bottom 0.381: 11.35,11.41 13.13,11.41 13.64,10.9 2_RFM12B.ANT | 11.35,11.41 8.31,11.41 7.8,11.92 2_RFM69.ANA | 11.35,11.41 8.05,8.11 5.26,8.11 4.5,7.34 U$5.P$1
2_AREF
  Top 0.254: C8.1 51.74,20.3 51.49,20.04 51.49,18.27 50.72,17.5 48.95,17.5 2_ATMEGA328.20
2_D0_RX  (via drill 0.61)
  Top 0.254: v43.61,19.28 43.61,22.08 2_ATMEGA328.30 | v31.67,18.52 26.09,18.52 v26.09,19.54 | v19.48,17.76 19.74,17.5 19.74,12.42 | 19.74,12.42 19.74,8.87 v18.72,7.85 | v48.69,12.93 48.69,9.63 46.91,7.85 JP1.2 | 19.74,12.42 v19.48,12.42
  Bottom 0.254: v43.61,19.28 36.25,19.28 35.48,18.52 v31.67,18.52 | v26.09,19.54 24.31,17.76 v19.48,17.76 | v18.72,7.85 17.7,6.84 17.7,5.57 20.5,5.57 21.51,4.55 U$6.37 | v48.69,12.93 48.18,13.44 24.31,13.44 23.29,12.42 v19.48,12.42
2_D1_TX  (via drill 0.61)
  Top 0.254: v42.6,16.49 42.6,22.08 2_ATMEGA328.31 | v23.29,14.46 22.78,13.95 v22.78,8.11 22.78,3.03 21.77,2.01 U$6.38 | v34.72,8.11 v36.75,10.14
  Bottom 0.254: v42.6,16.49 40.56,14.46 v23.29,14.46 | v36.75,10.14 41.33,10.14 41.58,10.39 JP1.5 | v22.78,8.11 v34.72,8.11
2_D2_IRQ  (via drill 0.61)
  Top 0.152: v35.48,31.73 35.23,31.47 35.23,20.04 v35.48,19.79
  Top 0.254: v40.82,22.58 40.82,22.33 41.58,22.33 2_ATMEGA328.32 | v33.45,19.79 33.2,19.54 3_OOK.1
  Bottom 0.254: v40.82,22.58 40.82,19.79 v35.48,19.79 v33.45,19.79 | v35.48,31.73 33.71,33.51 33.45,33.51 32.94,34.01 2IRQ.3
2_D3  (via drill 0.61)
  Top 0.254: v39.8,21.82 40.31,21.31 40.31,20.81 2_ATMEGA328.1
  Bottom 0.254: v39.8,21.82 34.47,21.82 R6.1
2_D3_INT1
  Bottom 0.254: R6.2 32.44,21.57 32.44,19.54 30.66,19.54 29.9,18.77 2_RFM12B.NFFS/OOK 29.64,18.52 27.61,18.52 27.36,18.27 2_RFM69.DIO2/OOK
2_D4_LED  (via drill 0.61)
  Top 0.254: v4.5,36.3 4.5,35.54 3.99,35.03 R102.1 | v22.53,37.06 24.31,38.84 24.31,44.94 25.07,45.7 26.34,45.7 26.34,40.36 25.83,39.86 25.83,34.01 28.63,31.22 34.47,31.22 v34.47,23.35 | v38.79,22.84 38.79,20.81 39.55,20.04 40.31,20.04 2_ATMEGA328.2
  Bottom 0.254: v4.5,36.3 5.26,37.06 v22.53,37.06 | v34.47,23.35 34.98,22.84 v38.79,22.84
2_D5_BBB  (via drill 0.61)
  Top 0.254: v39.29,6.84 39.29,11.15 41.58,13.44 2_ATMEGA328.9
  Bottom 0.254: v39.29,6.84 40.56,5.57 43.36,5.57 44.37,4.55 U$6.19
2_D6_BBB  (via drill 0.33)
  Top 0.152: v40.56,7.09 40.56,10.9 42.34,12.68 42.34,13.19 42.6,13.44 2_ATMEGA328.10 | v45.64,6.07 46.91,4.8 46.91,4.55 U$6.17
  Bottom 0.152: v40.56,7.09 41.58,6.07 v45.64,6.07
2_D7_IRQ  (via drill 0.61)
  Top 0.152: v42.6,11.92 43.36,12.68 43.36,13.44 2_ATMEGA328.11
  Top 0.254: v24.05,9.12 24.31,9.38 24.31,27.41 v24.56,27.66 | v29.64,27.66 31.17,29.19 v31.17,30.2 | 43.36,13.44 2_ATMEGA328.11
  Bottom 0.152: v42.6,11.92 42.34,11.66 32.94,11.66
  Bottom 0.254: 32.94,11.66 30.15,8.87 24.31,8.87 v24.05,9.12 | v29.64,27.66 v24.56,27.66 | v31.17,30.2 31.93,30.97 32.69,30.97 2IRQ.1
2_D8_SS  (via drill 0.61)
  Top 0.254: v25.32,25.12 25.32,26.39 25.83,26.9 R12.2 | v22.53,24.11 21.51,23.09 v21.51,13.44 v21.51,9.12 | v15.67,9.12 13.89,9.12 13.89,8.87 3_RFM12B.SEL 13.64,8.61 13.64,7.85 9.32,7.85 7.8,9.38 3_RFM69.NSS | v44.12,14.96 44.12,13.69 2_ATMEGA328.12
  Bottom 0.254: v25.32,25.12 24.31,24.11 v22.53,24.11 | v15.67,9.12 v21.51,9.12 | v44.12,14.96 43.1,13.95 24.05,13.95 23.55,13.44 v21.51,13.44
2_D9_IRQ  (via drill 0.61)
  Top 0.152: v45.26,12.17 45.14,12.17 45.14,13.44 2_ATMEGA328.13
  Top 0.254: v31.42,11.92 30.91,11.92 29.9,10.9 3_RFM12B.IRQ 29.64,10.9 28.37,9.63 27.36,9.63 3_RFM69.DIO0 | 44.88,13.44 2_ATMEGA328.13
  Bottom 0.152: 32.44,12.93 44.37,12.93 45.14,12.17 v45.26,12.17
  Bottom 0.254: v31.42,11.92 32.44,12.93
2_D10_SS  (via drill 0.61)
  Top 0.254: v23.29,25.12 23.29,26.9 R11.2 | v45.39,20.81 45.39,17 45.64,16.74 45.64,13.69 2_ATMEGA328.14 | v43.61,23.6 39.55,23.6 v39.55,25.12
  Bottom 0.254: v23.29,25.12 21.51,25.12 19.48,23.09 | 19.48,23.09 19.23,22.84 13.89,22.84 2_RFM12B.SEL 13.64,22.58 8.05,22.58 7.8,22.33 2_RFM69.NSS | v45.39,20.81 45.39,23.6 v43.61,23.6 | v39.55,25.12 26.59,25.12 24.56,23.09 19.48,23.09
2_D11_MOSI  (via drill 0.33)
  Top 0.152: v40.06,27.92 36.25,24.11 v36.25,21.06 | v31.42,20.55 30.66,19.79 v27.1,19.79 | v23.55,18.52 22.02,17 22.02,15.22 v22.28,14.96 | v16.69,19.54 v16.69,15.73 13.89,12.93 3_RFM12B.SDI 13.89,12.68 15.16,11.41 15.16,10.14 14.91,9.88 9.07,9.88 9.07,10.14 7.8,11.41 3_RFM69.MOSI 7.54,11.41 6.27,10.14 6.27,8.87 7.54,7.6 7.54,0.74 39.8,0.74 40.56,1.5 40.56,4.55 43.1,7.09 43.1,11.41 45.64,11.41 46.41,12.17 46.41,13.44 2_ATMEGA328.15
  Bottom 0.152: MOSI.1 38.79,27.92 v40.06,27.92 | v36.25,21.06 35.99,20.81 33.71,20.81 33.45,21.06 33.45,22.58 31.93,22.58 31.42,22.08 v31.42,20.55 | v27.1,19.79 26.59,20.3 25.83,20.3 24.05,18.52 v23.55,18.52 | v22.28,14.96 22.02,15.22 19.48,15.22 18.97,15.73 v16.69,15.73 | v16.69,19.54 14.66,19.54 13.89,18.77 2_RFM12B.SDI
  Bottom 0.254: 2_RFM12B.SDI 13.64,18.77 12.88,19.54 8.31,19.54 7.8,20.04 2_RFM69.MOSI
2_D12_MISO  (via drill 0.61)
  Top 0.254: v45.9,9.12 47.17,9.12 47.93,9.88 47.93,10.9 47.68,11.15 47.68,13.44 2_ATMEGA328.16 | v31.67,9.12 29.9,9.12 29.9,8.87 3_RFM12B.SDO 29.64,8.61 v27.1,6.07 | v9.58,17.25 7.29,17.25 6.27,16.23 6.27,13.69 7.54,13.69 3_RFM69.MISO | v33.45,27.16 31.67,25.38 v31.67,23.35 | v18.21,26.65 18.21,20.04 v17.96,19.79 17.45,19.28 17.45,14.46 17.7,14.2 17.7,7.6 v18.72,6.58
  Bottom 0.254: v31.67,9.12 v45.9,9.12 | 2_RFM69.MISO 7.8,18.01 8.81,18.01 v9.58,17.25 10.08,17.76 15.93,17.76 v17.96,19.79 | MISO.1 40.56,27.16 v33.45,27.16 32.94,26.65 v18.21,26.65 | v31.67,23.35 31.17,22.84 29.9,22.84 2_RFM12B.SDO | v27.1,6.07 19.23,6.07 v18.72,6.58
2_D13_SCK  (via drill 0.61)
  Top 0.254: v53.77,27.66 55.04,26.39 55.04,17.76 55.3,17.5 v55.3,16.23 | v49.96,13.95 48.95,14.96 2_ATMEGA328.17 48.69,15.22 46.41,15.22 v46.41,17.25 | 10.34,15.22 10.59,15.22 10.59,13.95 13.64,10.9 3_RFM12B.SCK | 10.34,15.22 7.8,15.22 3_RFM69.SCK | v10.34,16.23 10.34,15.22
  Bottom 0.254: SCK.1 52.76,27.66 v53.77,27.66 | 17.7,18.27 18.97,19.54 18.97,20.55 18.47,20.55 18.21,20.81 13.89,20.81 2_RFM12B.SCK | 17.7,18.27 15.67,16.23 v10.34,16.23 7.8,16.23 2_RFM69.SCK | v46.41,17.25 46.15,17.5 39.04,17.5 37.26,15.73 20.24,15.73 17.7,18.27 | v55.3,16.23 53.01,13.95 v49.96,13.95
2_IRQ  (via drill 0.61)
  Top 0.254: v18.72,29.7 19.23,29.19 19.23,22.84 v19.99,22.08
  Bottom 0.254: v18.72,29.7 22.02,33 32.44,33 32.69,32.74 2IRQ.2 | v19.99,22.08 27.1,22.08 2_RFM69.DIO0 27.36,22.08 28.37,22.08 29.64,20.81 2_RFM12B.IRQ
2_RST  (via drill 0.61)
  Top 0.254: v57.33,27.66 57.33,23.09 56.57,22.33 C6.2 | v20.5,3.28 20.5,18.27 21.01,18.77 21.01,24.11 19.74,25.38 v19.74,36.05
  Bottom 0.254: v57.33,27.66 56.82,28.17 RST.1 54.79,28.68 54.03,28.68 54.03,31.98 54.28,32.24 54.28,32.74 53.52,33.51 51.23,33.51 50.22,34.52 48.44,34.52 47.93,34.01 37.26,34.01 35.74,35.54 20.24,35.54 v19.74,36.05 | v20.5,3.28 27.86,3.28 29.13,2.01 U$6.32
3_ANA
  Top 0.381: 3RF.1 3.73,28.93 4.24,28.93 U$2.P$1 4.5,28.93 6.02,28.93 6.02,20.81 7.54,19.28 3_RFM69.ANA 7.8,19.54 11.1,19.54 12.37,20.81 13.64,20.81 3_RFM12B.ANT
3_INT
  Top 0.254: 29.9,13.19 33.2,13.19 R7.2 | 29.9,13.19 29.9,12.93 3_RFM12B.NFFS/OOK 29.9,13.19 | 29.9,13.19 29.9,13.44 27.36,13.44 3_RFM69.DIO2/OOK
+3V3  (via drill 0.61)
  Top 0.356: 2_ATMEGA328.6 40.56,16.74 41.58,16.74 41.58,17.76 41.07,18.27 40.56,18.27 2_ATMEGA328.4 40.31,18.27 v38.53,18.27 | 54.28,20.3 R5.1 54.28,20.3 | v51.23,16.74 50.72,16.74 49.96,15.98 48.95,15.98 2_ATMEGA328.18 | v53.77,35.79 53.77,36.81 54.03,37.06 R1.1 | 1_ATMEGA328.18 49.45,37.57 50.22,37.57 50.47,37.32 50.47,36.55 v50.98,36.05 50.72,35.79 50.72,33.25 49.71,32.24 48.18,32.24 48.18,30.46 47.42,29.7 44.37,29.7 ISP.2 | v59.36,36.3 59.36,44.94 60.63,44.94 3V3.2 | 19.74,44.68 22.02,46.97 27.1,46.97 1_RFM69.VDD 27.36,46.97 27.36,42.4 v31.42,38.33 | 19.74,44.68 18.72,43.67 18.72,42.9 13.89,42.9 1_RFM12B.VDD | v15.93,12.42 16.69,11.66 v16.69,10.14 | 23.29,28.68 20.75,28.68 | 20.75,28.68 R10.1 20.75,28.68 | 23.29,28.68 R11.1 23.29,28.68 | 23.29,28.68 25.83,28.68 R12.1 26.09,28.43 27.1,27.41 v27.1,24.11 27.1,21.57 3_RFM69.VDD 27.1,21.31 27.1,21.06 v25.32,21.06 25.07,20.81 25.07,13.19 v26.34,11.92 | v15.67,21.82 15.67,19.03 13.89,19.03 3_RFM12B.VDD | 19.74,44.68 20.75,43.67 20.75,28.68 | v42.34,38.33 40.82,38.33 1_ATMEGA328.6 | 54.28,20.3 v54.28,17.25
  Top 0.406: 1_ATMEGA328.4 42.34,40 v42.34,38.33
  Bottom 0.356: 46.91,18.27 45.39,19.79 44.88,19.79 42.6,22.08 42.6,24.11 | 46.91,18.27 47.68,17.5 51.23,17.5 51.23,17.25 | 42.6,24.11 42.6,25.63 43.36,25.63 45.64,27.92 45.64,30.97 ISP.2 | 51.23,17.25 v51.23,16.74 | 46.91,18.27 v38.53,18.27 | v50.98,36.05 53.52,36.05 v53.77,35.79 58.85,35.79 v59.36,36.3 | v15.93,12.42 14.15,12.42 13.89,12.68 2_RFM12B.VDD | v16.69,10.14 24.56,10.14 24.82,9.88 26.34,9.88 | 26.34,9.88 27.1,9.88 2_RFM69.VDD 26.34,9.88 | v15.67,21.82 15.93,21.57 18.97,21.57 19.48,21.06 v25.32,21.06 | v26.34,11.92 26.34,9.88 | 42.6,24.11 35.23,24.11 34.98,24.36 27.36,24.36 v27.1,24.11 | v31.42,38.33 v42.34,38.33 | 51.23,17.25 v54.28,17.25
+5V  (via drill 0.33, 0.61)
  Top 0.356: 10.34,29.95 10.34,37.32 10.59,37.57 v10.59,39.09 | 10.34,29.95 10.34,28.93 10.08,28.68 R3.2 | v12.12,29.95 12.12,28.68 R2.2 | 10.34,29.95 v10.08,29.95 | v55.3,44.94 5V.2 | v60.38,20.81 60.38,17.25 60.12,17 PIEZO.1 | v61.14,28.68 v61.14,25.63 | v60.12,30.2 60.12,35.54 60.38,35.79 v60.38,41.89 | v70.79,7.09 73.58,7.09 IR-TX.1
  Bottom 0.356: 10.08,39.6 9.58,40.11 3.48,40.11 LED.2 | 10.08,39.6 v10.59,39.09 | v10.08,29.95 v12.12,29.95 | 10.08,39.6 12.62,42.14 24.31,42.14 26.85,44.68 27.36,45.19 43.1,45.19 43.61,44.68 44.12,44.68 44.63,45.19 49.45,45.19 49.71,44.94 v55.3,44.94 57.33,44.94 v60.38,41.89 | v60.38,20.81 60.38,25.63 v61.14,25.63 | v61.14,28.68 61.14,30.2 v60.12,30.2 | v70.79,7.09 61.14,16.74 60.12,16.74 PIEZO.1
BBB_3V3
  Top 0.356: 3V3.1 60.88,46.46 64.69,50.27 U$6.50 64.95,50.27 64.95,52.56 U$6.49
BBB_5V
  Top 0.356: 5V.3 59.87,48.75 62.15,48.75 62.15,50.02 U$6.52 62.41,50.27 62.41,52.56 U$6.51
DTR  (via drill 0.61)
  Top 0.254: v61.65,22.84 61.9,22.84 63.93,20.81 FTDI.6
  Bottom 0.254: RST.2 55.8,29.19 57.33,29.19 58.6,27.92 58.6,26.65 | 58.6,26.65 51.23,26.65 ISP.5 | v61.65,22.84 61.65,24.87 62.15,25.38 62.15,26.65 58.6,26.65
GND  (via drill 0.61)
  Top 0.356: ISP.6 51.99,33.51 51.99,37.06 C5.2 | 32.94,2.01 33.08,2.15 32.94,2.01 | 32.94,1.76 33.08,1.76 32.94,1.76
  Top 0.406: 40.72,39.22 1_ATMEGA328.5
  Bottom 0.356: 13.89,14.71 2_RFM12B.GND | 57.07,8.36 v56.95,8.36 | 15.16,15.47 15.22,15.31 15.16,15.47
  other vias: 54.91,47.6 57.96,33.89 48.82,33.51 36.37,36.3 55.93,5.95 52.38,9.12 49.71,8.74 49.96,12.04 55.68,12.04 36.75,17.88 36.75,7.98 30.4,3.28 31.04,16.74 11.61,14.46 9.7,13.31 6.65,4.93 3.61,13.69 13.13,31.22 54.91,33.89 37.13,48.11 47.42,39.35 54.66,42.02 31.04,43.16 21.89,44.68 24.56,30.2 50.09,24.11 23.04,16.74 22.66,19.41 19.99,19.03 18.47,14.84 50.09,21.82 50.34,18.52 46.53,20.04 38.02,3.28 62.66,13.06 24.18,7.22 11.61,18.65 10.46,21.7 48.44,47.22 41.58,48.37 33.2,47.6 45.77,51.41 16.56,13.69 11.61,34.01 17.32,40.49 22.66,39.73 34.85,10.39 27.23,36.68 6.65,31.73 63.68,39.6 66.34,46.84 58.34,39.98 22.02,27.66 17.58,28.05 9.32,5.69 31.8,27.92 36.25,28.55 10.85,8.74 63.04,17.25
  pour Top: -13.67,63.22 101.4,63.22 101.02,-10.31 -14.81,-10.31
  pour Bottom: -11.76,59.03 96.06,59.03 96.44,-6.5 -11,-6.5
KLINKE2_BBB  (via drill 0.33)
  Top 0.152: 73.58,3.53 IR-TX.2 73.58,3.53 | 73.58,3.53 71.81,3.53 v71.68,3.53
  Bottom 0.152: U$6.8 59.87,1.76 60.88,0.74 67.74,0.74 68.76,0.74 71.55,3.53 v71.68,3.53
N$1
  Top 0.254: 1_ATMEGA328.7 40.56,37.57 39.8,37.57 39.04,38.33 38.28,38.33 X1.1
N$2  (via drill 0.61)
  Top 0.356: 61.9,43.41 63.68,43.41 63.68,42.65 IC1.3 | 61.9,43.41 60.88,43.41 3V3.3 | 61.9,43.41 v61.9,42.14
  Bottom 0.356: C1.1 68.5,47.98 68.5,45.7 C2.1 68.25,45.7 67.23,44.68 64.44,44.68 v61.9,42.14
N$3
  Top 0.254: 2_ATMEGA328.7 40.31,15.98 37.77,15.98 X2.1
N$4
  Bottom 0.152: R100.2 81.46,6.58 80.95,7.09 78.92,7.09 BC817-40_2.C
N$10
  Top 0.254: 2_ATMEGA328.8 40.31,14.96 39.04,13.69 37.77,13.69 X2.3
N$11  (via drill 0.61)
  Top 0.254: 53.77,15.98 55.04,14.71 56.31,14.71 56.31,20.3 C6.1 | 53.77,15.98 53.26,16.49 53.26,21.31 54.03,22.08 R5.2 | v44.63,16.49 44.63,19.54 44.37,19.79 44.37,22.08 2_ATMEGA328.29 | 53.77,15.98 v53.26,15.47
  Bottom 0.254: v44.63,16.49 46.15,14.96 50.22,14.96 50.72,14.46 52.25,14.46 v53.26,15.47
N$12
  Top 0.254: 3_OOK.2 33.2,14.96 R7.1
N$13
  Bottom 0.254: BC817-40_1.C 62.66,9.38 60.12,9.38 PIEZO.2
N$14  (via drill 0.61)
  Top 0.254: C3.1 56.31,39.09 54.28,39.09 R1.2 54.03,39.09 54.03,40.11 v53.01,41.13 | v47.93,41.13 46.66,41.13 44.63,43.16 44.63,43.67 1_ATMEGA328.29
  Bottom 0.254: v53.01,41.13 v47.93,41.13
N$15
  Bottom 0.254: R103.2 60.38,11.92 61.9,10.39 64.95,10.39 BC817-40_1.B
N$16  (via drill 0.61)
  Top 0.254: C100.2 14.4,26.9 12.37,26.9 R2.1 12.12,26.9 v9.83,24.62 | v4.5,23.35 3.48,22.33 3.48,20.55 IR-RX.VCC
  Bottom 0.254: v9.83,24.62 5.77,24.62 v4.5,23.35
N$17  (via drill 0.33)
  Top 0.152: IR-TX.4-2 83.24,10.9 v81.71,9.38 81.71,4.8 83.24,3.28 IR-TX.4
  Bottom 0.152: v81.71,9.38 81.71,8.11 R100.1
N$19
  Bottom 0.152: R101.2 73.58,6.33 76.63,6.33 BC817-40_2.B
N$21  (via drill 0.61)
  Top 0.254: v40.56,35.41 40.56,36.55 1_ATMEGA328.8 | v38.53,35.03 38.28,35.28 38.28,36.05 X1.3
  Bottom 0.254: v38.53,35.03 40.31,35.03 40.56,35.28 v40.56,35.41
N$22
  Top 0.254: R102.2 2.46,35.03 3.23,35.79 3.23,37.57 LED.1
N$23
  Bottom 0.254: MISO.2 42.09,29.19 43.61,29.19 ISP.1
N$24  (via drill 0.61)
  Top 0.254: v37.01,30.2 36.75,30.46 v36.75,32.24
  Bottom 0.254: MOSI.2 38.02,30.2 v37.01,30.2 | v36.75,32.24 45.64,32.24 ISP.4
N$25
  Bottom 0.254: SCK.2 48.18,29.7 ISP.3
USB_UART_RXD
  Bottom 0.152: JP1.3 44.37,10.39 45.39,11.41 49.2,11.41 49.45,11.15 52.5,11.15 59.61,18.27 61.65,18.27 62.15,18.77 62.15,22.33 62.92,22.33 63.93,23.35 FTDI.5
USB_UART_TXD  (via drill 0.61)
  Top 0.254: v48.44,5.57 48.44,3.28 46.41,3.28 45.9,3.79 45.9,4.55 44.88,5.57 44.88,7.34 44.37,7.85 JP1.4 | v63.42,6.84 64.44,7.85 64.44,18.27 63.17,19.54 62.15,19.54 62.15,21.06 60.63,22.58 60.63,23.09 63.42,25.89 63.93,25.89 FTDI.4
  Bottom 0.254: v48.44,5.57 49.71,6.84 v63.42,6.84
VIN  (via drill 0.61)
  Top 0.356: v66.98,43.67 66.22,44.43 66.22,44.94 63.93,47.22 IC1.1 | 5V.1 58.34,42.65 v58.34,41.89 | v61.14,31.22 61.14,40.62 v61.39,40.87
  Bottom 0.356: C4.1 68.25,43.67 v66.98,43.67 64.19,40.87 v61.39,40.87 59.36,40.87 v58.34,41.89 | v61.14,31.22 63.93,28.43 FTDI.3

### Text on the board
tNames: BBB | VIN | GND | VCC | TXD | RXD | DTR | IR-RX | RX | 2TX | 1TX | USB-Select | 1RX | 2RX | TX | Version 1.0
bNames: INT0 | 1 | 1 | AIN1 | 2 | 2